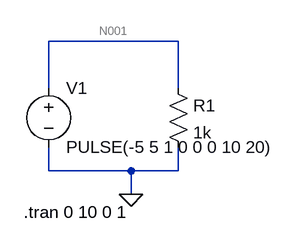
[diagram p0: schematic Draft7.asc]
Draft7.asc, the LTspice schematic file:
Version 4
SHEET 1 880 680
WIRE 336 48 160 48
WIRE 160 112 160 48
WIRE 336 112 336 48
WIRE 160 224 160 192
WIRE 272 224 160 224
WIRE 336 224 336 192
WIRE 336 224 272 224
WIRE 272 256 272 224
FLAG 272 256 0
SYMBOL voltage 160 96 R0
WINDOW 123 0 0 Left 0
WINDOW 39 0 0 Left 0
SYMATTR InstName V1
SYMATTR Value PULSE(-5 5 1 0 0 0 10 20)
SYMBOL res 320 96 R0
SYMATTR InstName R1
SYMATTR Value 1k
TEXT 126 280 Left 2 !.tran 0 10 0 1

The netlist it stands for:
* Draft7.asc
V1 N001 0 PULSE(-5 5 1 0 0 0 10 20)
R1 N001 0 1k
.tran 0 10 0 1
.backanno
.end

* Results of the author's LTspice run, read from the files saved beside the schematic
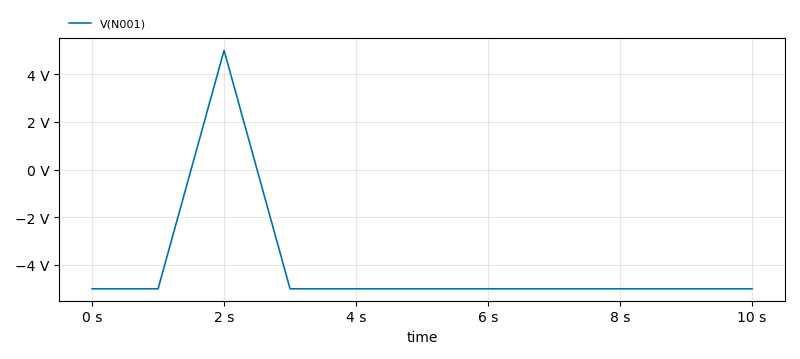
[diagram p1: Transient Analysis of Draft7.asc, plotted from the saved traces]
* Transient Analysis, 1 run:
*   V(N001): min -5 V, max 5 V, average -4 V, rms 5 V, last -5 V